# Altium schematic sheet RS485_3.SchDoc
size 381 x 241 mm; SheetNumber: 3; SheetTotal: 3
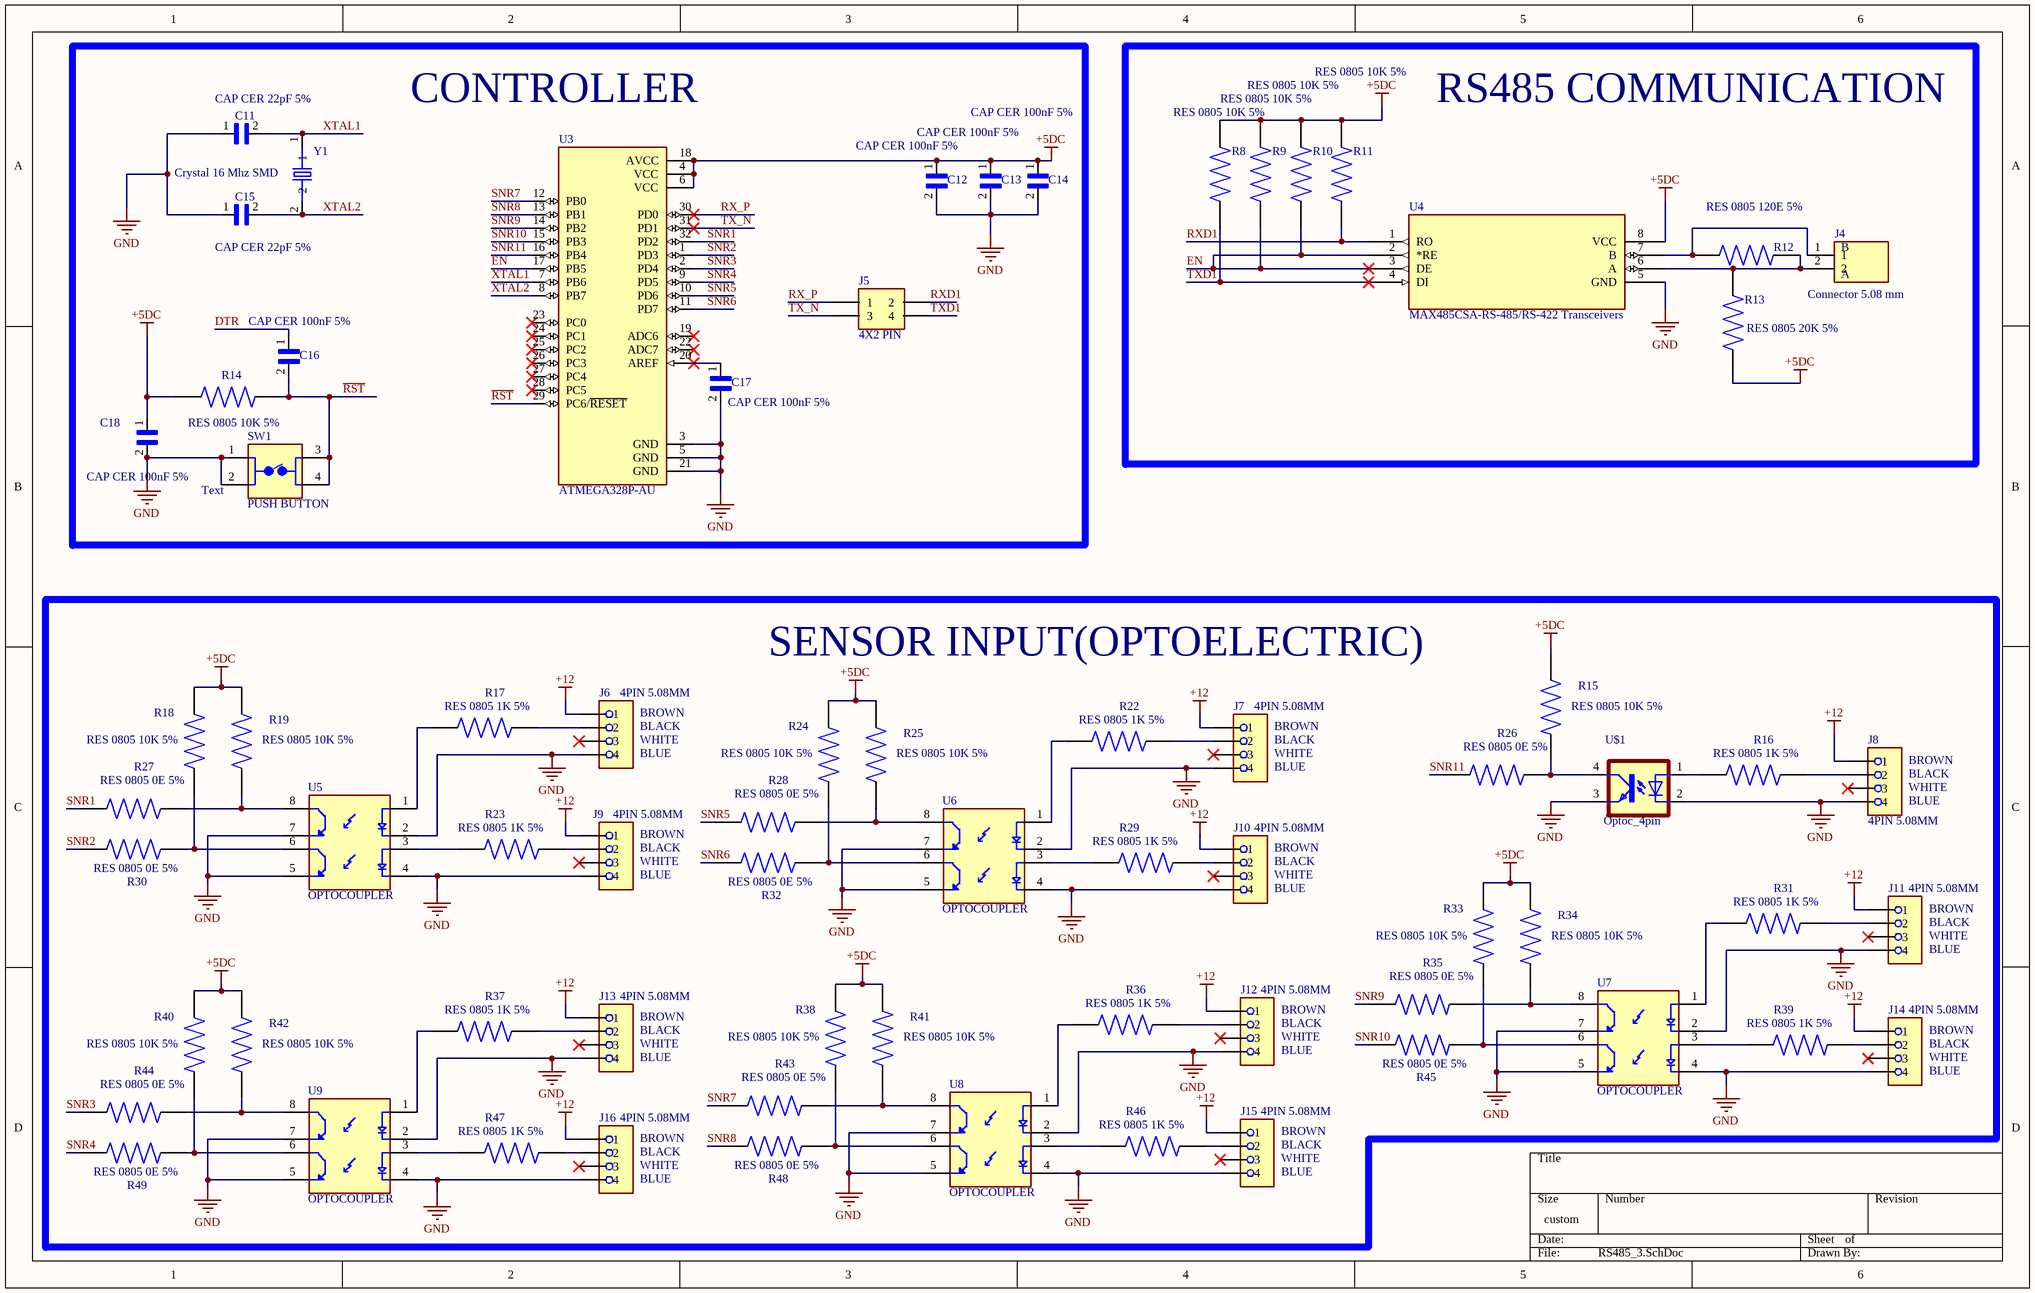
[diagram p0: RS485_3.SchDoc]

## Parts
C11  CAP CER 22pF 5%  [CAP CER 100pF 5%]
C12  CAP CER 100nF 5%  [CAP CER 100pF 5%]
C13  CAP CER 100nF 5%  [CAP CER 100pF 5%]
C14  CAP CER 100nF 5%  [CAP CER 100pF 5%]
C15  CAP CER 22pF 5%  [CAP CER 100pF 5%]
C16  CAP CER 100nF 5%  [CAP CER 100pF 5%]
C17  CAP CER 100nF 5%  [CAP CER 100pF 5%]
C18  CAP CER 100nF 5%  [CAP CER 100pF 5%]
J4  Connector 5.08 mm  [Connector 5.08 mm]
J5  4X2 PIN  [4PIN BURGE]
J6  4PIN 5.08MM  [TERMINSL SCREW]
J7  4PIN 5.08MM  [TERMINSL SCREW]
J8  4PIN 5.08MM  [TERMINSL SCREW]
J9  4PIN 5.08MM  [TERMINSL SCREW]
J10  4PIN 5.08MM  [TERMINSL SCREW]
J11  4PIN 5.08MM  [TERMINSL SCREW]
J12  4PIN 5.08MM  [TERMINSL SCREW]
J13  4PIN 5.08MM  [TERMINSL SCREW]
J14  4PIN 5.08MM  [TERMINSL SCREW]
J15  4PIN 5.08MM  [TERMINSL SCREW]
J16  4PIN 5.08MM  [TERMINSL SCREW]
R8  RES 0805 10K 5%  [RES 0805 10K 5%]
R9  RES 0805 10K 5%  [RES 0805 10K 5%]
R10  RES 0805 10K 5%  [RES 0805 10K 5%]
R11  RES 0805 10K 5%  [RES 0805 10K 5%]
R12  RES 0805 120E 5%  [RES 0805 10K 5%]
R13  RES 0805 20K 5%  [RES 0805 10K 5%]
R14  RES 0805 10K 5%  [RES 0805 10K 5%]
R15  RES 0805 10K 5%  [RES 0805 10K 5%]
R16  RES 0805 1K 5%  [RES 0805 10K 5%]
R17  RES 0805 1K 5%  [RES 0805 10K 5%]
R18  RES 0805 10K 5%  [RES 0805 10K 5%]
R19  RES 0805 10K 5%  [RES 0805 10K 5%]
R22  RES 0805 1K 5%  [RES 0805 10K 5%]
R23  RES 0805 1K 5%  [RES 0805 10K 5%]
R24  RES 0805 10K 5%  [RES 0805 10K 5%]
R25  RES 0805 10K 5%  [RES 0805 10K 5%]
R26  RES 0805 0E 5%  [RES 0805 10K 5%]
R27  RES 0805 0E 5%  [RES 0805 10K 5%]
R28  RES 0805 0E 5%  [RES 0805 10K 5%]
R29  RES 0805 1K 5%  [RES 0805 10K 5%]
R30  RES 0805 0E 5%  [RES 0805 10K 5%]
R31  RES 0805 1K 5%  [RES 0805 10K 5%]
R32  RES 0805 0E 5%  [RES 0805 10K 5%]
R33  RES 0805 10K 5%  [RES 0805 10K 5%]
R34  RES 0805 10K 5%  [RES 0805 10K 5%]
R35  RES 0805 0E 5%  [RES 0805 10K 5%]
R36  RES 0805 1K 5%  [RES 0805 10K 5%]
R37  RES 0805 1K 5%  [RES 0805 10K 5%]
R38  RES 0805 10K 5%  [RES 0805 10K 5%]
R39  RES 0805 1K 5%  [RES 0805 10K 5%]
R40  RES 0805 10K 5%  [RES 0805 10K 5%]
R41  RES 0805 10K 5%  [RES 0805 10K 5%]
R42  RES 0805 10K 5%  [RES 0805 10K 5%]
R43  RES 0805 0E 5%  [RES 0805 10K 5%]
R44  RES 0805 0E 5%  [RES 0805 10K 5%]
R45  RES 0805 0E 5%  [RES 0805 10K 5%]
R46  RES 0805 1K 5%  [RES 0805 10K 5%]
R47  RES 0805 1K 5%  [RES 0805 10K 5%]
R48  RES 0805 0E 5%  [RES 0805 10K 5%]
R49  RES 0805 0E 5%  [RES 0805 10K 5%]
SW1  PUSH BUTTON  [Push Button]
U3  ATMEGA328P-AU  [ATMEGA328P-AU]
U4  MAX485CSA-RS-485/RS-422 Transceivers  [MAX485CSA-RS-485/RS-422 Transceivers]
U5  OPTOCOUPLER  [OPTOCOUPLER]
U6  OPTOCOUPLER  [OPTOCOUPLER]
U7  OPTOCOUPLER  [OPTOCOUPLER]
U8  OPTOCOUPLER  [OPTOCOUPLER]
U9  OPTOCOUPLER  [OPTOCOUPLER]
U$1  Optoc_4pin  [Optoisolator]
Y1  Crystal 16 Mhz SMD  [Crystal 16 Mhz SMD]

## Blocks framed on the sheet
CONTROLLER: C11-C18 J5 R14 SW1 U3 Y1
RS485 COMMUNICATION: J4 R8-R13 U4
SENSOR INPUT(OPTOELECTRIC): J6-J16 R15-R19 R22-R49 U5-U9 U$1

## Nets
+5DC: C12.1 C13.1 C14.1 C18.1 R8.2 R9.2 R10.2 R11.2 R13.1 R14.1 R15.2 R18.2 R19.2 R24.2 R25.2 R33.2 R34.2 R38.2 R40.2 R41.2 R42.2 U3.4(VCC) U3.6(VCC) U3.18(AVCC) U4.8(VCC)
+12: J6.1 J7.1 J8.1 J9.1 J10.1 J11.1 J12.1 J13.1 J14.1 J15.1 J16.1
GND: C11.1 C12.2 C13.2 C14.2 C15.1 C17.2 C18.2 J6.4 J7.4 J8.4 J9.4 J10.4 J11.4 J12.4 J13.4 J14.4 J15.4 J16.4 SW1.1 SW1.2 U3.3(GND) U3.5(GND) U3.21(GND) U4.5(GND) U5.2 U5.4 U5.5 U5.7 U6.2 U6.4 U6.5 U6.7 U7.2 U7.4 U7.5 U7.7 U8.2 U8.4 U8.5 U8.7 U9.2 U9.4 U9.5 U9.7 U$1.2(C) U$1.3(EMIT)
DTR: C16.1
EN: R9.1 R10.1 U3.17(PB5) U4.2(*RE) U4.3(DE)
~{RST}: C16.2 R14.2 SW1.3 SW1.4 U3.29(PC6/~{RESET})
RX_P: J5.01(1) U3.30(PD0)
RXD1: J5.02(2) R11.1 U4.1(RO)
SNR1: R27.1 U3.32(PD2)
SNR2: R30.1 U3.1(PD3)
SNR3: R44.1 U3.2(PD4)
SNR4: R49.1 U3.9(PD5)
SNR5: R28.1 U3.10(PD6)
SNR6: R32.1 U3.11(PD7)
SNR7: R43.1 U3.12(PB0)
SNR8: R48.1 U3.13(PB1)
SNR9: R35.1 U3.14(PB2)
SNR10: R45.1 U3.15(PB3)
SNR11: R26.1 U3.16(PB4)
TX_N: J5.03(3) U3.31(PD1)
TXD1: J5.04(4) R8.1 U4.4(DI)
XTAL1: C11.2 U3.7(PB6) Y1.1
XTAL2: C15.2 U3.8(PB7) Y1.2
NetC17_1: C17.1 U3.20(AREF)
NetJ4_1: J4.1 R12.1 U4.7(B)
NetJ4_2: J4.2 R12.2 R13.2 U4.6(A)
NetJ6_2: J6.2 R17.1
NetJ7_2: J7.2 R22.1
NetJ8_2: J8.2 R16.1
NetJ9_2: J9.2 R23.1
NetJ10_2: J10.2 R29.1
NetJ11_2: J11.2 R31.1
NetJ12_2: J12.2 R36.1
NetJ13_2: J13.2 R37.1
NetJ14_2: J14.2 R39.1
NetJ15_2: J15.2 R46.1
NetJ16_2: J16.2 R47.1
NetR15_1: R15.1 R26.2 U$1.4(COL)
NetR16_2: R16.2 U$1.1(A)
NetR17_2: R17.2 U5.1
NetR18_1: R18.1 R30.2 U5.6
NetR19_1: R19.1 R27.2 U5.8
NetR22_2: R22.2 U6.1
NetR23_2: R23.2 U5.3
NetR24_1: R24.1 R32.2 U6.6
NetR25_1: R25.1 R28.2 U6.8
NetR29_2: R29.2 U6.3
NetR31_2: R31.2 U7.1
NetR33_1: R33.1 R45.2 U7.6
NetR34_1: R34.1 R35.2 U7.8
NetR36_2: R36.2 U8.1
NetR37_2: R37.2 U9.1
NetR38_1: R38.1 R48.2 U8.6
NetR39_2: R39.2 U7.3
NetR40_1: R40.1 R49.2 U9.6
NetR41_1: R41.1 R43.2 U8.8
NetR42_1: R42.1 R44.2 U9.8
NetR46_2: R46.2 U8.3
NetR47_2: R47.2 U9.3

Not connected (* = marked no-connect by the designer): J6 3*; J7 3*; J8 3*; J9 3*; J10 3*; J11 3*; J12 3*; J13 3*; J14 3*; J15 3*; J16 3*; U3 19(ADC6)* 22(ADC7)* 23(PC0)* 24(PC1)* 25(PC2)* 26(PC3)* 27(PC4)* 28(PC5)*

## Notes on the sheet
- (near J4) A
- (near J4) B
- (near SW1) Text
- (near J6) BROWN
- (near J6) BLACK
- (near J6) WHITE
- (near J6) BLUE
- (near J7) BROWN
- (near J7) BLACK
- (near J7) WHITE
- (near J7) BLUE
- (near J8) BROWN
- (near J8) BLACK
- (near J9) BROWN
- (near J8) WHITE
- (near J8) BLUE
- (near J9) BLACK
- (near J9) WHITE
- (near J9) BLUE
- (near J10) BROWN
- (near J10) BLACK
- (near J10) WHITE
- (near J10) BLUE
- (near J11) BROWN
- (near J11) BLACK
- (near J11) WHITE
- (near J11) BLUE
- (near J13) BROWN
- (near J13) BLACK
- (near J13) WHITE
- (near J12) BROWN
- (near J12) BLACK
- (near J12) WHITE
- (near J14) BROWN
- (near J14) BLACK
- (near J13) BLUE
- (near J12) BLUE
- (near J14) WHITE
- (near J14) BLUE
- (near J16) BROWN
- (near J16) BLACK
- (near J16) WHITE
- (near J16) BLUE
- (near J15) BROWN
- (near J15) BLACK
- (near J15) WHITE
- (near J15) BLUE

## Library data of the parts
C11-C18 = CAP CER 100pF 5%: CAP CER 100PF50V X7R 0805; MP: GCJ216R71H222KA01D; Package: None; Price: None; Value: *; Availability: Unavailable
J4 = Connector 5.08 mm: MOLEX,Screw Type, Horizontal, 5.08 Pitch, 24~12 (AWG), Terminal Block Connector; MF: Same Sky; MP: TB007-508-02BE; SnapEDA_Link: https://www.snapeda.com/parts/TB007-508-02BE/Same+Sky/view-part/?ref=snap; Package: None; Value: *; Check_prices: https://www.snapeda.com/parts/TB007-508-02BE/Same+Sky/view-part/?ref=eda
J5 = 4PIN BURGE: Connector Header Through Hole 4 position 0.100 (2.54mm), 4X2 PIN; MF: Samtec; MP: MTLW-102-05-G-D-180; SnapEDA_Link: https://www.snapeda.com/parts/MTLW-102-05-G-D-180/Samtec/view-part/?ref=snap; Package: None; Value: *; Check_prices: https://www.snapeda.com/parts/MTLW-102-05-G-D-180/Samtec/view-part/?ref=eda
J6-J16 = TERMINSL SCREW: TERMINSL SCREW, 4PIN, 5.08MM; MF: {'manufacturer': u'Phoenix Contact'}; MP: 1995664; Package: None; Price: None; Value: *; Availability: Unavailable
R8-R19 R22-R49 = RES 0805 10K 5%: RESISTOR, THICK FILM, 10K, 5%, 0805, FRESISTOR, THICK FILM, 10K, 5%, 0805, FULL REEL Product Range:PANASONIC - ERJ Series; MP: ERJ-6GEYJ103V; MF: Panasonic Electronic; Price: None; Check_prices: https://www.snapeda.com/parts/ERJ-6GEYJ103V/Panasonic+Electronic+Components/view-part/?ref=eda; Package: 805-2 Panasonic; Purchase-URL: https://pricing.snapeda.com/search/part/ERJ-6GEYJ103V/?ref=eda; Availability: In Stock; SnapEDA_Link: https://www.snapeda.com/parts/ERJ-6GEYJ103V/Panasonic+Electronic+Components/view-part/?ref=snap; Value: *
SW1 = PUSH BUTTON: Switch Push Button OFF (ON) SPST Round Button 0.05A 24VDC Momentary Contact PC Pins Thru-Hole; MF: TE Connectivity; MP: 3-1825910-1; SnapEDA_Link: https://www.snapeda.com/parts/3-1825910-1/TE+Connectivity+ALCOSWITCH+Switches/view-part/?ref=snap; Package: None; Value: *; Check_prices: https://www.snapeda.com/parts/3-1825910-1/TE+Connectivity+ALCOSWITCH+Switches/view-part/?ref=eda
U3 = ATMEGA328P-AU: AVR AVRÂ® ATmega Microcontroller IC 8-Bit 20MHz 32KB (16K x 16) FLASH 32-TQFP (7x7); MF: Microchip; SnapEDA_Link: https://www.snapeda.com/parts/ATMEGA328P-AU/Microchip/view-part/?ref=snap; Package: TQFP-32 Microchip; Value: *; MP: ATMEGA328P-AU; Check_prices: https://www.snapeda.com/parts/ATMEGA328P-AU/Microchip/view-part/?ref=eda
U4 = MAX485CSA-RS-485/RS-422 Transceivers: Low-Power, Slew-Rate-Limited RS-485/RS-422 Transceivers; MF: Analog Devices; MP: MAX485CSA+; SnapEDA_Link: https://www.snapeda.com/parts/MAX485CSA+/Analog+Devices/view-part/?ref=snap; Package: SOIC-8 Maxim; Value: *; Check_prices: https://www.snapeda.com/parts/MAX485CSA+/Analog+Devices/view-part/?ref=eda
U5-U9 = OPTOCOUPLER: TLP521-2,Optoisolateur Ã  sortie transistor 5300 Vrms 2 canaux 8 DIP; MF: Toshiba; SnapEDA_Link: https://www.snapeda.com/parts/TLP521-2/Toshiba/view-part/?ref=snap; Package: DIP-8 Toshiba; Value: *; MP: TLP521-2; Check_prices: https://www.snapeda.com/parts/TLP521-2/Toshiba/view-part/?ref=eda
U$1 = Optoc_4pin: TLP521-1,Optoisolator Transistor Output 5300Vrms 1 Channel 4-DIP; MF: Isocom; SnapEDA_Link: https://www.snapeda.com/parts/TLP521-1/Isocom/view-part/?ref=snap; Package: DIP-4 Isocom Components; Value: *; MP: TLP521-1; Check_prices: https://www.snapeda.com/parts/TLP521-1/Isocom/view-part/?ref=eda
Y1 = Crystal 16 Mhz SMD: 16 Mhz Crystal SMD –CSM-4ALX(28ALX) 12.5mmX4.85mmX4mm; MF: Fox Electronics; MP: FOXSDLF/128-20; SnapEDA_Link: https://www.snapeda.com/parts/FOXSDLF/128-20/Fox+Electronics/view-part/?ref=snap; Package: HC49SD Fox Electronics; Value: *; Check_prices: https://www.snapeda.com/parts/FOXSDLF/128-20/Fox+Electronics/view-part/?ref=eda